# Altium schematic sheet 5V0_REG.SchDoc
size C; SheetNumber: 4; SheetTotal: 20
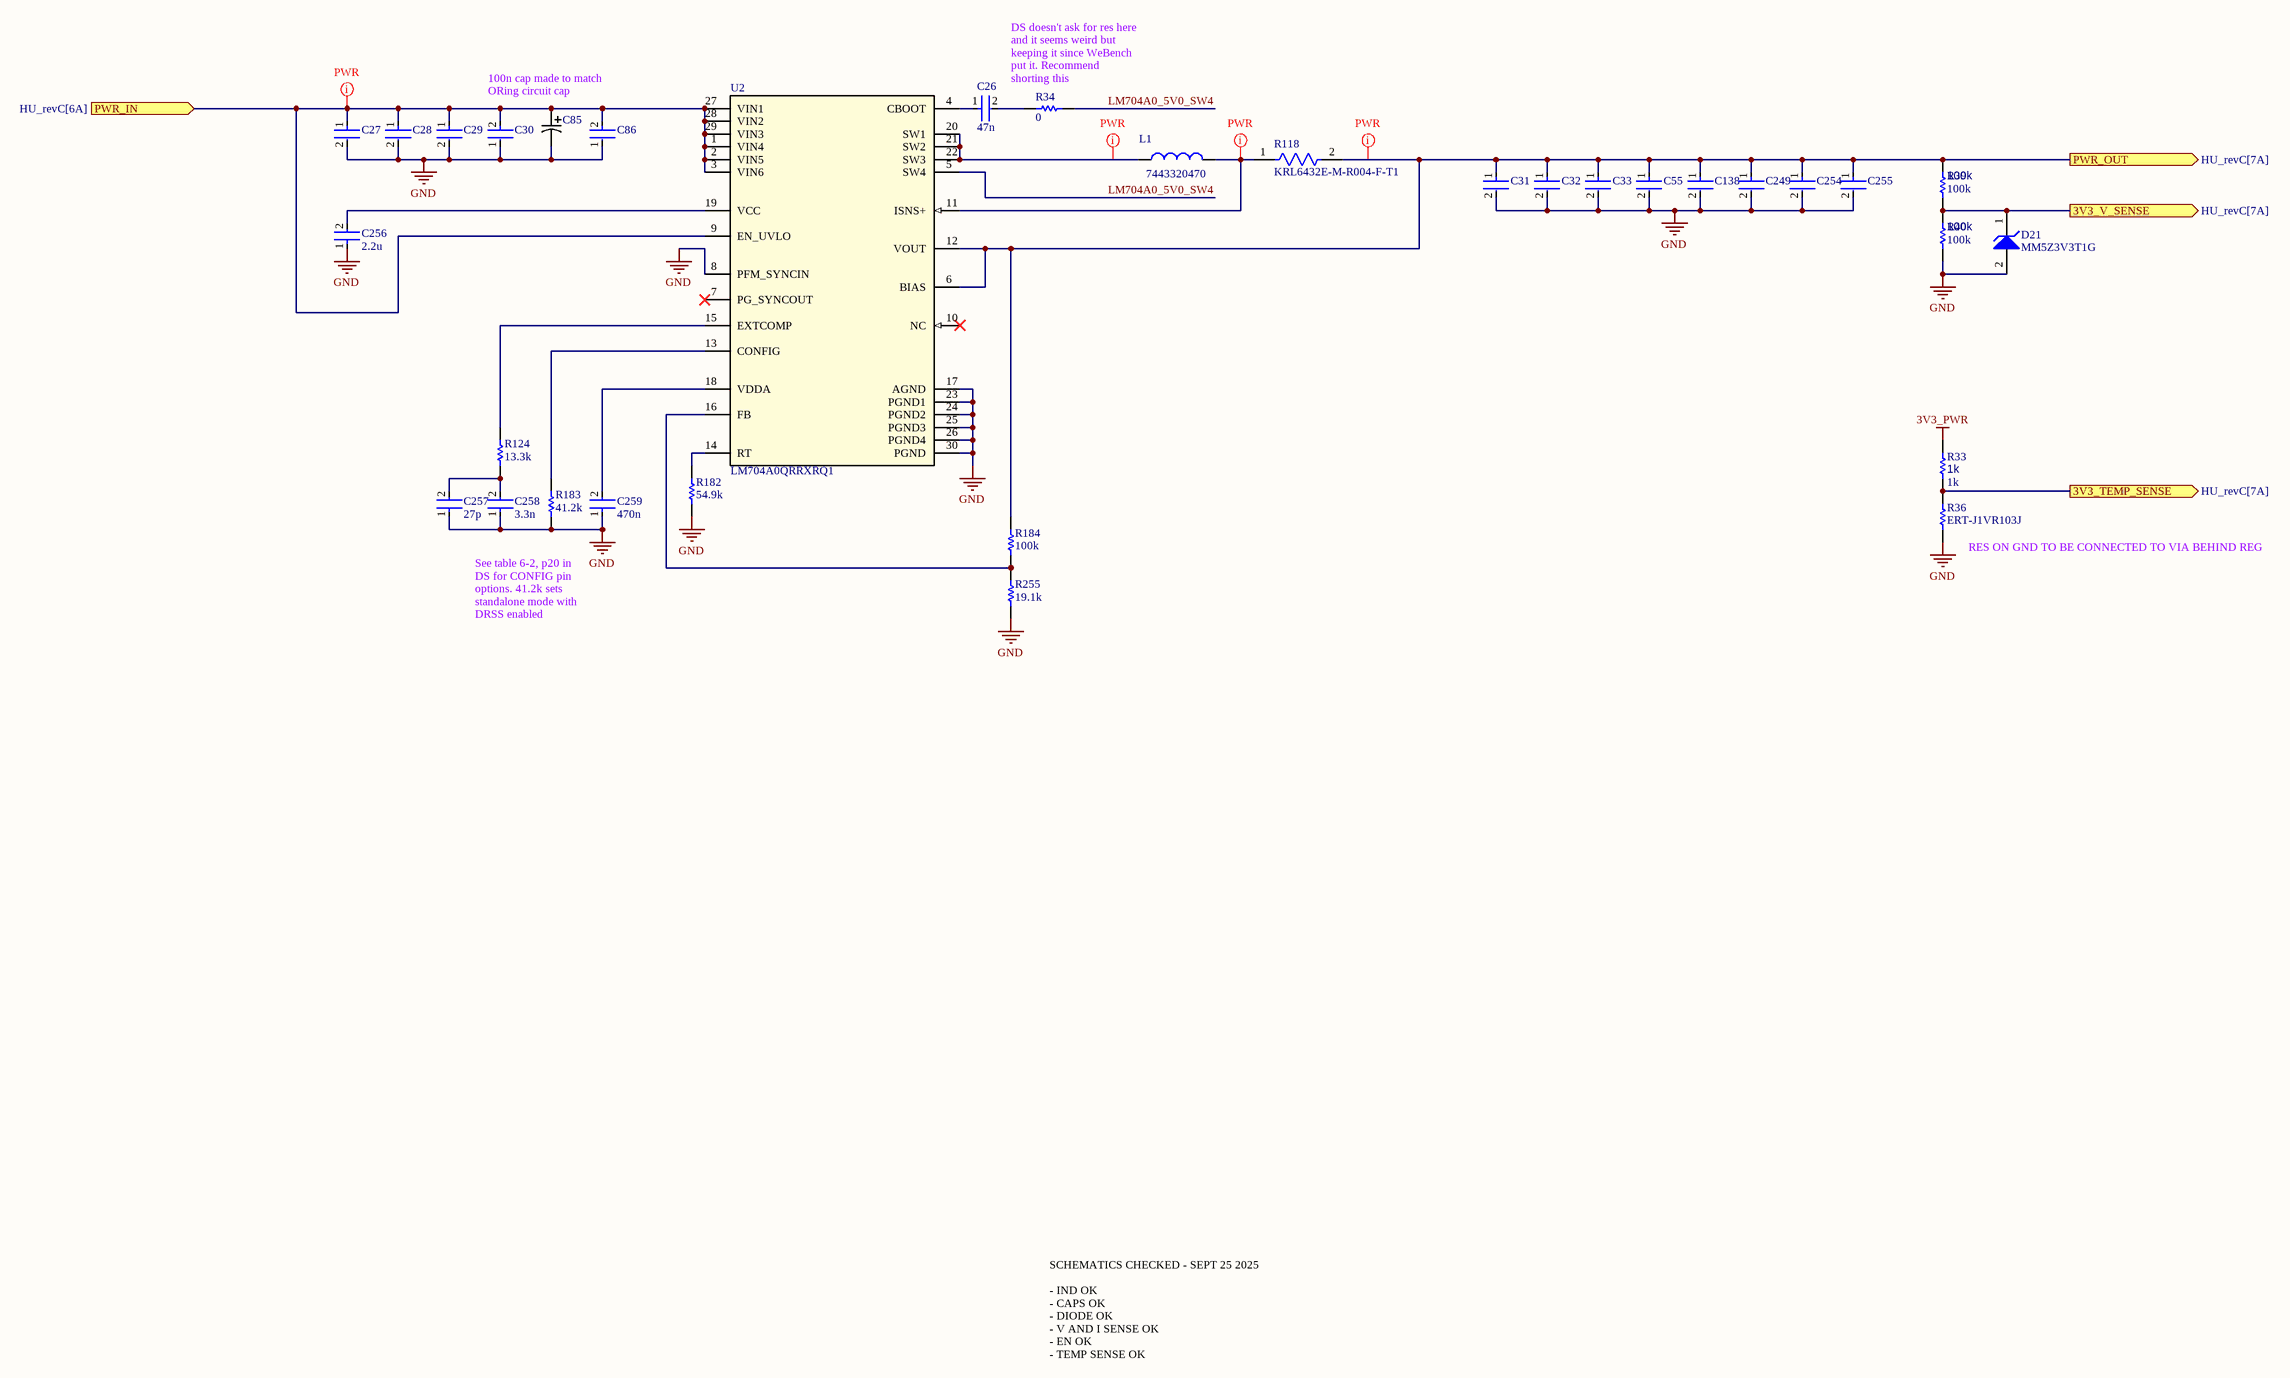
[diagram p0: 5V0_REG.SchDoc]

## Parts
C26  47n  [FP-0402-L_1_0_0_05-W_0_5-IPC_A]
C27  C3225X7R1H106M250AC  [FP-C3225-250-0_4-MFG]  (value not drawn)
C28  C3225X7R1H106M250AC  [FP-C3225-250-0_4-MFG]  (value not drawn)
C29  C3225X7R1H106M250AC  [FP-C3225-250-0_4-MFG]  (value not drawn)
C30  AC1210KKX7R0BB104  [FP-AC1210-0_85-MFG]  (value not drawn)
C31  GRM32ER61C476KE15L  [FP-GRM32E-0_3-0_2-IPC_C]  (value not drawn)
C32  GRM32ER61C476KE15L  [FP-GRM32E-0_3-0_2-IPC_C]  (value not drawn)
C33  GRM32ER61C476KE15L  [FP-GRM32E-0_3-0_2-IPC_C]  (value not drawn)
C55  GRM32ER61C476KE15L  [FP-GRM32E-0_3-0_2-IPC_C]  (value not drawn)
C85  DNP  [T495D337K010ATE150-Footprint-1]  (value not drawn)
C86  AC1210KKX7R0BB104  [FP-AC1210-0_85-MFG]  (value not drawn)
C138  GRM32ER61C476KE15L  [FP-GRM32E-0_3-0_2-IPC_C]  (value not drawn)
C249  GRM32ER61C476KE15L  [FP-GRM32E-0_3-0_2-IPC_C]  (value not drawn)
C254  GRM32ER61C476KE15L  [FP-GRM32E-0_3-0_2-IPC_C]  (value not drawn)
C255  GRM32ER61C476KE15L  [FP-GRM32E-0_3-0_2-IPC_C]  (value not drawn)
C256  2.2u  [FP-0402-L_1_0_0_05-W_0_5-IPC_A]
C257  27p  [FP-0402-L_1_0_0_05-W_0_5-IPC_A]
C258  3.3n  [FP-0402-L_1_0_0_05-W_0_5-IPC_A]
C259  470n  [FP-0402-L_1_0_0_05-W_0_5-IPC_A]
D21  MM5Z3V3T1G  [ONSC-SOD-523-2-502-01_V]
L1  7443320470  [WE-HCC_1210]
R33  1k  [R0603B]
R34  0  [R0603B]
R36  ERT-J1VR103J  [RESC1608X90X30ML15T20]
R39  100k  [R0603B]
R40  100k  [R0603B]
R118  KRL6432E-M-R004-F-T1  [FP-KRL6432E-MFG]
R124  13.3k  [R0603B]
R182  54.9k  [R0603B]
R183  41.2k  [R0603B]
R184  100k  [R0603B]
R255  19.1k  [R0603B]
U2  LM704A0QRRXRQ1  [LM704A0QRRXRQ1-Footprint-1]

## Ports
3V3_TEMP_SENSE (out, see HU_revC[7A]), 3V3_V_SENSE (out, see HU_revC[7A]), PWR_IN (in, see HU_revC[6A]), PWR_OUT (out, see HU_revC[7A])

## Nets
3V3_PWR: R33.1
GND: C27.2 C28.2 C29.2 C30.1 C31.2 C32.2 C33.2 C55.2 C85.2 C86.1 C138.2 C249.2 C254.2 C255.2 C256.1 C257.1 C258.1 C259.1 D21.2(A) R36.1 R40.1 R182.2 R183.2 R255.2 U2.8(PFM_SYNCIN) U2.17(AGND) U2.23(PGND1) U2.24(PGND2) U2.25(PGND3) U2.26(PGND4) U2.30(PGND)
3V3_TEMP_SENSE: R33.2 R36.2 ; port 3V3_TEMP_SENSE
3V3_V_SENSE: D21.1(K) R39.1 R40.2 ; port 3V3_V_SENSE
LM704A0_5V0_SW4: R34.2 U2.5(SW4)
PWR_IN: C27.1 C28.1 C29.1 C30.2 C85.1 C86.2 U2.1(VIN4) U2.2(VIN5) U2.3(VIN6) U2.9(EN_UVLO) U2.27(VIN1) U2.28(VIN2) U2.29(VIN3) ; port PWR_IN
PWR_OUT: C31.1 C32.1 C33.1 C55.1 C138.1 C249.1 C254.1 C255.1 R39.2 R118.2 R184.1 U2.6(BIAS) U2.12(VOUT) ; port PWR_OUT
NetC26_1: C26.1 U2.4(CBOOT)
NetC26_2: C26.2 R34.1
NetC256_2: C256.2 U2.19(VCC)
NetC257_2: C257.2 C258.2 R124.1
NetC259_2: C259.2 U2.18(VDDA)
NetL1_1: L1.1 U2.20(SW1) U2.21(SW2) U2.22(SW3)
NetL1_2: L1.2 R118.1 U2.11(ISNS+)
NetR124_2: R124.2 U2.15(EXTCOMP)
NetR182_1: R182.1 U2.14(RT)
NetR183_1: R183.1 U2.13(CONFIG)
NetR184_2: R184.2 R255.1 U2.16(FB)

Not connected (* = marked no-connect by the designer): U2 7(PG_SYNCOUT)* 10(NC)*

## Layout directives
net class PWR: NetL1_1, NetL1_2, PWR_IN, PWR_OUT

## Notes on the sheet
- 100n cap made to match ORing circuit cap
- DS doesn't ask for res here and it seems weird but keeping it since WeBench put it. Recommend shorting this
- (near R36) RES ON GND TO BE CONNECTED TO VIA BEHIND REG
- See table 6-2, p20 in DS for CONFIG pin options. 41.2k sets standalone mode with DRSS enabled
- SCHEMATICS CHECKED - SEPT 25 2025
  - IND OK
  - CAPS OK
  - DIODE OK
  - V AND I SENSE OK
  - EN OK
  - TEMP SENSE OK

## Library data of the parts
C26 C256-C259 = CMP-001-00058-1: LARGE PADS, 0402 CAP, CHANGE COMMENT TO MATCH REAL P/N; Capacitor Type: Ceramic; Min Operating Temperature: -55°C; Mounting Technology: Surface Mount; Pins: 2; Case/Package: 0402; RoHS Compliant: Yes; Max Operating Temperature: 85°C
C27-C29 = CMP-08246-002653-1: Multilayer Ceramic Capacitors 10uF ±20% 50V X7R SMD 1210; Width: 0.098inch; Package Quantity: 1000; Height: 2.5mm; Dielectric Material: Ceramic; Voltage Rating: 50V; Series: C; Capacitance: 10uF; Tolerance: 20%; Weight: 0.000564oz; Case/Package: 1210; Case Code (Imperial): 1210; Dielectric: X7R; Case Code (Metric): 3225; REACH SVHC: No SVHC; Packaging: Tape and Reel; Length: 0.126inch; Termination: SMD/SMT; Min Operating Temperature: -55°C; Voltage Rating (DC): 50V; Lead Free: Lead Free; Max Operating Temperature: 125°C; Thickness: 0.11inch; Mount: Surface Mount
C30 C86 = CMP-03422-000642-1: CAP CER 0.1UF 100V X7R 1210; Manufacturer: Yageo; Automotive Grade: Grade 1; Capacitance: 100 nF; Material: Ceramic; Value: 100 nF; Temperature Coefficient: 15%; Tolerance: 0.1; Automotive: Yes; ComponentLink2Description: Datasheet; Device Class L2: Capacitors; Height: 0.95mm; Manufacturer Part Number: AC1210KKX7R0BB104; Temperature: -55°C to +125°C; Voltage Rating: 100 V; Device Class L1: Passive Components; ComponentLink2URL: http://www.yageo.com/documents/recent/UPY-AC_NP0X7R_16V-to-630V_12.pdf; Lead Free: Yes; Category: Cap; Temperature Range High: +125°C; RoHS: TRUE; Digikey Description: CAP CER 0.1UF 100V X7R 1210; Temperature Range Low: -55°C; Octopart: https://octopart.com/ac1210kkx7r0bb104-yageo-78873719; Device Class L3: Ceramic Capacitors; Ipc Land Pattern Name: CAPC320250X85; Package: AC1210-0.85; Footprint Url: http://www.yageo.com/exep/pages/download/literatures/UPY-C_GEN_24.pdf; Temperature Characteristic: X7R
C31-C33 C55 C138 C249 C254 C255 = CMP-2000-06362-2: CAP CER 47UF 16V X5R 1210; Tolerance: 10%; Material: Ceramic; Case Code (Metric): 3225; RoHS Compliant: Yes; Min Operating Temperature: -55°C; Radiation Hardening: No; Voltage: 16V; Package Quantity: 1; Case Code (Imperial): 1210; REACH SVHC: No SVHC; Capacitance: 47uF; Voltage Rating (DC): 16V; Dielectric: X5R; Case/Package: 1210; Length: 3.2mm; Voltage Rating: 16V; Packaging: Cut Tape; Width: 0.098inch; Number of Pins: 2; Lead Free: Lead Free; Height: 2.5mm; Mount: Surface Mount; Termination: SMD/SMT; Max Operating Temperature: 85°C; Thickness: 0.106inch; Depth: 2.5mm
C85 = CMP-001-00067-2: T495X107K020ATE150 diff p/n; Tolerance: 10%; Voltage Rating: 10V; Value: 330µF; Case/Package: 2917; Min Operating Temperature: -55°C; Mounting Technology: Surface Mount; Max Operating Temperature: 125°C
D21 = CMP-1060-00750-1: Zener Voltage Regulator, 500 mW, 2-Pin SOD-523, Pb-Free, Tape and Reel; Manufacturer: On Semiconductor; P Max (W): 0.5; VZ Typ (V): 3.3; RoHS: Pb-Free; ComponentLink2Description: Datasheet; PackageReference: SOD-523-2-502-01; DatasheetVersion: Rev. 10; ComponentLink1Description: Manufacturer URL; PackageVersion: Rev. E, 09/2010; ComponentLink3URL: http://www.onsemi.com/pub_link/Collateral/502-01.PDF; ComponentLink2URL: http://www.onsemi.cn/pub_link/Collateral/MM5Z2V4T1-D.PDF; Mounting Technology: Surface Mount; PartNumber: MM5Z3V3T1G; Packing: Tape and Reel; PackageDescription: 2-Pin SOD, Body 1.2 x 0.8 mm; ComponentLink1URL: http://www.onsemi.com/; ComponentLink3Description: Package Specification
L1 = CMP-0226-00121-3: We-hcc Series, Shielded Wire-wound SMD Inductor With Ferrite Core, 4.7 Uh; Inductance Tolerance: 20%; Self Resonant Frequency: 43MHz; Saturation Current: 15.6A; Current Rating: 15.5A; Inductance: 4.7µH; DC Resistance (DCR): 7.25mΩ; Width: 11.4mm; Core Material: Ferrite; Number of Pins: 2; Material: Ferrite; RoHS: Compliant; Length: 12.1mm; Max Operating Temperature: 125°C; Ambient Temperature Range Low: -40°C; Min Operating Temperature: -40°C; Height: 9.5mm; Ambient Temperature Range High: 75°C
R33 R34 R39 R40 R124 R182-R184 R255 = CMP-009-00002-14: Resistor
  R33: Value: 1k
  R39 R40: Value: 100k
R36 = CMP-2000-00869-1: Manufacturer: Panasonic; Part Number: ERT-J1VR103J
R118 = CMP-00597-24927457-1: KRL6432E-M-R004-F-T1 Metal Foil Low Resistance Chip Resistor (long-side terminal), 2512, RoHS; Power Rating: 3W; Temperature Coefficient: 50ppm/°C; Tolerance: 1%; Resistance: 4mΩ; Length: 3.1mm; Composition: Metal Foil; Termination: SMD/SMT; Max Operating Temperature: 155°C; Case Code (Imperial): 2512; NexarPartId: 24927457; Width: 6.3mm; Max Power Dissipation: 3W; Case Code (Metric): 6432; Min Operating Temperature: -55°C; Packaging: Digi-Reel®; Max Thickness: 700µm; Lifecycle Status: Production; Height: 700µm; Weight: 40.511469mg; Case/Package: 2512; RoHS: Compliant; Number of Terminations: 2
U2 = CMP-019-00058-1: Automotive, High-density, 4.5V to 45V input, 10A low-EMI synchronous DC/DC step-down converter 29-VQFN -40 to 150; Case/Package: VQFN; Pins: 29